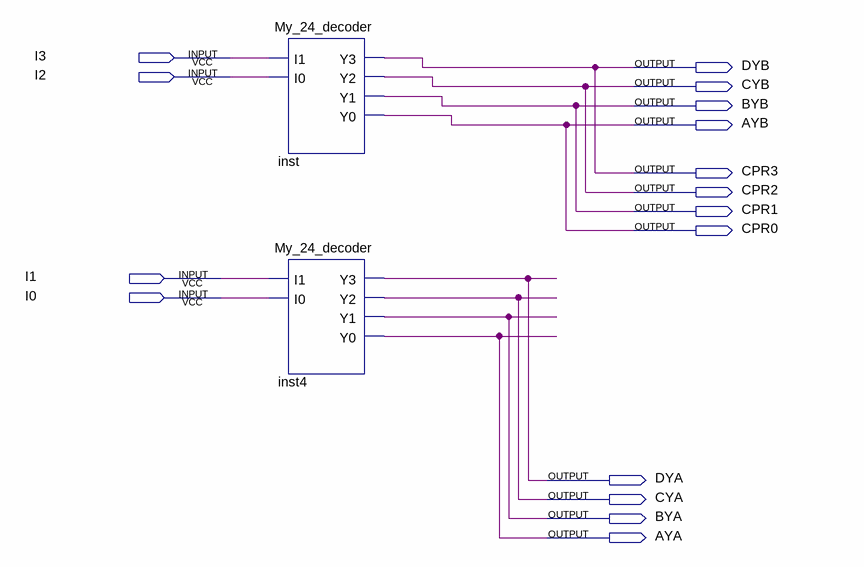
[diagram p0: schematic sheet]
// Quartus schematic My_IR_Decoder.bdf as structural Verilog: 2 symbols, 16 pins
module My_IR_Decoder (
  input  I3,
  input  I2,
  input  I1,
  input  I0,
  output DYB,
  output CYB,
  output BYB,
  output AYB,
  output CPR3,
  output CPR2,
  output CPR1,
  output CPR0,
  output DYA,
  output CYA,
  output BYA,
  output AYA
);

  My_24_decoder inst (.I1(I3), .I0(I2), .Y3(CPR3), .Y2(CPR2), .Y1(BYB), .Y0(AYB));
  My_24_decoder inst4 (.I1(I1), .I0(I0), .Y3(DYA), .Y2(CYA), .Y1(BYA), .Y0(AYA));

  assign CPR0 = AYB;
  assign CPR1 = BYB;
  assign CYB = CPR2;
  assign DYB = CPR3;
endmodule
